# EAGLE design Rover_MDrv_V1_Sch (EAGLE 9.6.2)
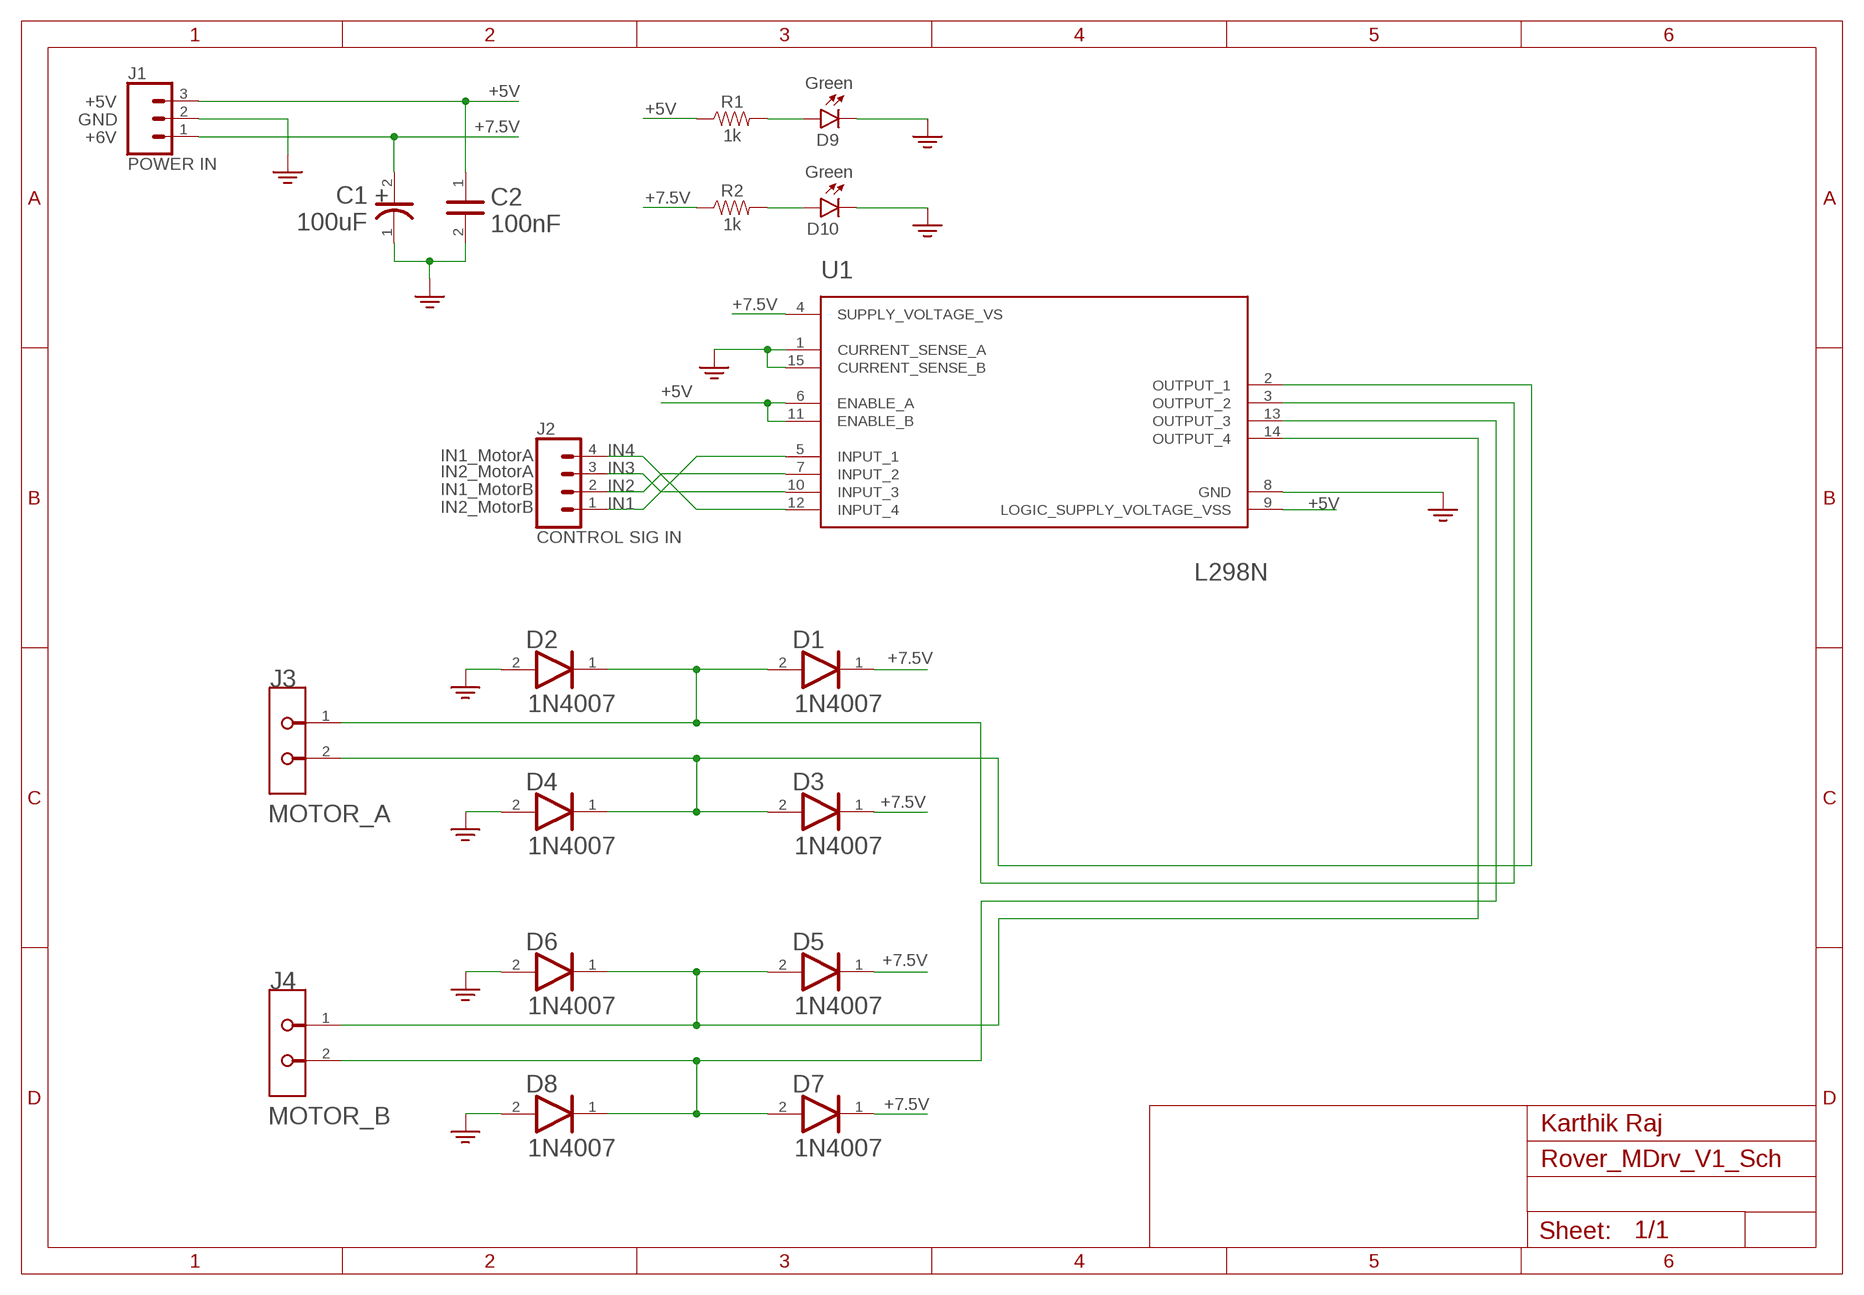
[diagram p0: schematic, sheet 1]

## Parts
C1  100uF  PANASONIC_EEU-FR1C101PANASONIC_EEU-FR1C101_0_0  [PANASONIC_EEU-FR1C101_0]
C2  100nF  AVX_CK05BX104KAVX_CK05BX104K_0_0  [AVX_CK05BX104K_0]
D1  DIOTEC_1N4007DIOTEC_1N4007_0_0  [DIOTEC_1N4007_0]
D2  DIOTEC_1N4007DIOTEC_1N4007_0_0  [DIOTEC_1N4007_0]
D3  DIOTEC_1N4007DIOTEC_1N4007_0_0  [DIOTEC_1N4007_0]
D4  DIOTEC_1N4007DIOTEC_1N4007_0_0  [DIOTEC_1N4007_0]
D5  DIOTEC_1N4007DIOTEC_1N4007_0_0  [DIOTEC_1N4007_0]
D6  DIOTEC_1N4007DIOTEC_1N4007_0_0  [DIOTEC_1N4007_0]
D7  DIOTEC_1N4007DIOTEC_1N4007_0_0  [DIOTEC_1N4007_0]
D8  DIOTEC_1N4007DIOTEC_1N4007_0_0  [DIOTEC_1N4007_0]
D9  Green  LED3MM  [LED_3MM]
D10  Green  LED3MM  [LED_3MM]
J1  POWER IN  CONN_03  [1X03]
J2  CONTROL SIG IN  CONN_04PTH  [1X04]
J3  MOTOR_A  TE_282837-2TE_282837-2_0_0  [TE_282837-2_0]
J4  MOTOR_B  TE_282837-2TE_282837-2_0_0  [TE_282837-2_0]
R1  1k  RESISTORAXIAL-0.3  [AXIAL-0.3]
R2  1k  RESISTORAXIAL-0.3  [AXIAL-0.3]
U1  STMICROELECTRONICS_L298NSTMICROELECTRONICS_L298N_0_0  [STMICROELECTRONICS_L298N_0]

## Nets
+5V: C2.1 J1.3 R1.P$1 U1.6(ENABLE_A) U1.9(LOGIC_SUPPLY_VOLTAGE_VSS) U1.11(ENABLE_B)
+7.5V: C1.2(ANODE) D1.1(CATHODE) D3.1(CATHODE) D5.1(CATHODE) D7.1(CATHODE) J1.1 R2.P$1 U1.4(SUPPLY_VOLTAGE_VS)
GND: C1.1(CATHODE) C2.2 D2.2(ANODE) D4.2(ANODE) D6.2(ANODE) D8.2(ANODE) D9.K(C) D10.K(C) J1.2 U1.1(CURRENT_SENSE_A) U1.8(GND) U1.15(CURRENT_SENSE_B) ; supply symbol labelled GND2
IN1: J2.1 U1.5(INPUT_1)
IN2: J2.2 U1.7(INPUT_2)
IN3: J2.3 U1.10(INPUT_3)
IN4: J2.4 U1.12(INPUT_4)
N$1: D9.A R1.P$2
N$2: D10.A R2.P$2
OUT1: D3.2(ANODE) D4.1(CATHODE) J3.2 U1.2(OUTPUT_1)
OUT2: D1.2(ANODE) D2.1(CATHODE) J3.1 U1.3(OUTPUT_2)
OUT3: D7.2(ANODE) D8.1(CATHODE) J4.2 U1.13(OUTPUT_3)
OUT4: D5.2(ANODE) D6.1(CATHODE) J4.1 U1.14(OUTPUT_4)

## Notes on the sheet
- +5V
- GND
- +6V
- IN1_MotorA
- IN2_MotorA
- IN1_MotorB
- IN2_MotorB
- Karthik Raj

## Library data of the parts
C1 = RMDrv_100uF_FilCap_16SEPC100M:PANASONIC_EEU-FR1C101: Aluminum Electrolytic Capacitors (Radial Lead Type); CAPACITANCE: 100.0µF; CENTROID_NOT_SPECIFIED: No; DATASHEET: https://industrial.panasonic.com/cdbs/www-data/pdf/RDF0000/ABA0000C1259.pdf; DIGIKEY_DESCRIPTION: CAP 100µF 16V Aluminum Electrolytic Capacitors Radial, Can 5000 Hrs @ 105°C; DIGIKEY_PART_NUMBER: P14391-ND; LEAD_FREE: yes; MF: Panasonic; MOUSER_PART_NUMBER: 667-EEU-FR1C101; MPN: EEU-FR1C101; PACKAGE: RADIAL; PREFIX: C; ROHS: yes; TEMPERATURE_RANGE_HIGH: +105°C; TEMPERATURE_RANGE_LOW: 40°C; VOLTAGE: 16V
C2 = RMDrv_0.1uF_FilCap_CK05BX104K:AVX_CK05BX104K: Multilayer Ceramic Capacitors; CAPACITANCE: 100.0nF; CENTROID_NOT_SPECIFIED: Yes; DATASHEET: http://datasheets.avx.com/CK05-06.pdf; DIGIKEY_DESCRIPTION: CAP 0.10µF ±10% 50V Ceramic Capacitor BX Radial; DIGIKEY_PART_NUMBER: 1010-1198-ND; IMPORTED_FROM: octopart; IPC_LAND_PATTERN_NAME: CAPRD508W85D483H483; LEAD_FREE: Unknown; MF: AVX; MOUNTING_TYPE: through hole; MOUSER_PART_NUMBER: 581-CK05BX104K; MPN: CK05BX104K; NUM_PINS: 2; PACKAGE: CAP_SMT_4MM83_2MM29; PREFIX: C; ROHS: Unknown; SYMBOL_0_0: Capacitor; TEMPERATURE_COEFFICIENT: BX; TEMPERATURE_RANGE_HIGH: +125°C; TEMPERATURE_RANGE_LOW: -55°C; TOLERANCE: ±10%; TYPE: capacitor; VOLTAGE: 50V
D1-D8 = 1N4007:DIOTEC_1N4007: Rectifier diode 1000 V 1 A DO-41, ,; AUTOMOTIVE: No; CAPACITANCE: 15pF; CENTROID_NOT_SPECIFIED: No; DATASHEET: https://datasheet.octopart.com/1N4007-Diotec-datasheet-62346875.pdf; DEVICE_CLASS_L1: Discrete Semiconductors; DEVICE_CLASS_L2: Diodes; DEVICE_CLASS_L3: Rectifier Diodes; FOOTPRINT_PARAMETERS_0: {"fp_type":"Axial","params":{"N":{"long name":"Number of leads","type":"fixed","short name":"N","value":2},"L":{"nom":false,"long name":"Package length","min":false,"max":5200000,"short name":"L","type":"measurement"},"D":{"nom":false,"long name":"Package diameter","min":false,"max":2800000,"short name":"D","type":"measurement"},"d":{"nom":770000,"long name":"Lead diameter","min":700000,"max":840000,"short name":"d","type":"measurement"},"e":{"nom":8880000,"long name":"Lead spacing","min":null,"max":null,"short name":"e","type":"measurement"},"P":{"default":"false","long name":"Polarized","type":"multichoice","short name":"P"},"offset x":{"nom":0,"long name":"X Center offset","min":null,"max":null,"short name":"offset x","type":"measurement"},"offset y":{"nom":0,"long name":"Y Center offset","min":null,"max":null,"short name":"offset y","type":"measurement"},"LS":{"default":"Circle","long name":"Land shape","type":"multichoice","short name":"LS"},"LS1":{"default":"Square","long name":"Land shape (Pin 1)","type":"multichoice","short name":"LS1"}}}; FOOTPRINT_VARIANT_NAME_0: Recommended_Land_Pattern; FORWARD_CURRENT: 1A; HEIGHT: 2.8mm; IPC_LAND_PATTERN_NAME: DIOAD888W100L520D280; LEAD_FREE: Yes; MAX_JUNCTION_TEMP: +175°C; MAX_REPETITIVE_REVERSE_VOLTAGE: 1000V; MAX_SURGE_FORWARD_CURRENT: 27A; MF: Diotec; MFG_PACKAGE_IDENT: 1N4007; MFG_PACKAGE_IDENT_DATE: 0; MFG_PACKAGE_IDENT_REV: 0; MPN: 1N4007; PACKAGE: AXIAL; PEAK_REVERSE_CURRENT: 5uA; PREFIX: D; REVERSE_VOLTAGE: 1000V; ROHS: Yes; TEMPERATURE_RANGE_HIGH: +175°C; TEMPERATURE_RANGE_LOW: -50°C; VERIFICATION_VERSION: 0.0.0.3
D9 D10 = SparkFun-LED:LED: LED (Generic) Standard schematic elements and footprints for 5mm, 3mm, 1206, and 0603 sized LEDs. Generic LEDs with no color specified.; PROD_ID: DIO-08794
J1 = SparkFun-Connectors:CONN_03: Multi connection point. Often used as Generic Header-pin footprint for 0.1 inch spaced/style header connections On any of the 0.1 inch spaced packages, you can populate with these: Break Away Headers - Straight <https://www.sparkfun.com/products/116> (PRT-00116) Break Away Male Headers - Right Angle <https://www.sparkfun.com/products/553> (PRT-00553) Female Headers <https://www.sparkfun.com/products/115> (PRT-00115) Break Away Headers - Machine Pin <https://www.sparkfun.com/products/117> (PRT-00117) Break Away Female Headers - Swiss Machine Pin <https://www.sparkfun.com/products/743> (PRT-00743) Stackable Header - 3 Pin (Female, 0.1") <https://www.sparkfun.com/products/13875> (PRT-13875) For SCREWTERMINALS and SPRING TERMINALS visit here: Screw Terimnals on SparkFun.com <https://www.sparkfun.com/search/results?term=Screw+Terminals> (5mm/3.5mm/2.54mm spacing) This device is also useful as a general connection point to wire up your design to another part of your project. Our various solder wires solder well into these plated through hole pads. Hook-Up Wire - Assortment (Stranded, 22 AWG) <https://www.sparkfun.com/products/11375> (PRT-11375) Hook-Up Wire - Assortment (Solid Core, 22 AWG) <https://www.sparkfun.com/products/11367> (PRT-11367) View the entire wire category on our website here <https://www.sparkfun.com/categories/141> Special notes: Molex polarized connector foot print use with SKU : PRT-08232 with associated crimp pins and housings.; PROD_ID: XXX-00000; VALUE: 455-1750-1-ND
J2 = SparkFun-Connectors:CONN_04: Multi connection point. Often used as Generic Header-pin footprint for 0.1 inch spaced/style header connections On any of the 0.1 inch spaced packages, you can populate with these: Break Away Headers - Straight <https://www.sparkfun.com/products/116> (PRT-00116) Break Away Male Headers - Right Angle <https://www.sparkfun.com/products/553> (PRT-00553) Female Headers <https://www.sparkfun.com/products/115> (PRT-00115) Break Away Headers - Machine Pin <https://www.sparkfun.com/products/117> (PRT-00117) Break Away Female Headers - Swiss Machine Pin <https://www.sparkfun.com/products/743> (PRT-00743) For SCREWTERMINALS and SPRING TERMINALS visit here: Screw Terimnals on SparkFun.com <https://www.sparkfun.com/search/results?term=Screw+Terminals> (5mm/3.5mm/2.54mm spacing) This device is also useful as a general connection point to wire up your design to another part of your project. Our various solder wires solder well into these plated through hole pads. Hook-Up Wire - Assortment (Stranded, 22 AWG) <https://www.sparkfun.com/products/11375> (PRT-11375) Hook-Up Wire - Assortment (Solid Core, 22 AWG) <https://www.sparkfun.com/products/11367> (PRT-11367) View the entire wire category on our website here <https://www.sparkfun.com/categories/141> Special notes: Molex polarized connector foot print use with SKU : PRT-08231 with associated crimp pins and housings. 1MM SMD Version SKU: PRT-10208; PROD_ID: CONN-09696
J3 J4 = RMDrv_FinalNew_Conn_Terminal:TE_282837-2: Conn Terminal Blocks F 2 POS 5.08mm Solder ST Thru-Hole 13.5A/Contact; CENTROID_NOT_SPECIFIED: No; CONN_GENDER: Female; CONN_ORIENTATION: Horizontal; CONTACT_MATERIAL: Tin; CURRENT_RATING: 13.5A; DATASHEET: https://www.te.com/commerce/DocumentDelivery/DDEController?Action=showdoc&DocId=Catalog+Section%7F1308389_EUROSTYLE_TERMINAL_BLOCKS%7F0607%7Fpdf%7FEnglish%7FENG_CS_1308389_EUROSTYLE_TERMINAL_BLOCKS_0607.pdf%7F282837-2; DEVICE_CLASS_L1: Connectors; DEVICE_CLASS_L2: Terminal Blocks | Terminals; DEVICE_CLASS_L3: unset; DIGIKEY_DESCRIPTION: CONN TERM BLOCK 5.08MM 2POS SIDE ENTY; DIGIKEY_PART_NUMBER: A113320-ND; FOOTPRINT_URL: https://www.te.com/commerce/DocumentDelivery/DDEController?Action=showdoc&DocId=Customer+Drawing%7F282837%7FH%7Fpdf%7FEnglish%7FENG_CD_282837_H.pdf%7F282837-2; HEIGHT: 10.3mm; IS_FEMALE: yes; LEAD_FREE: yes; MAX_WIRE_GAUGE: 16; MF: TE; MFG_PACKAGE_IDENT: 282837-2; MFG_PACKAGE_IDENT_DATE: 0; MFG_PACKAGE_IDENT_REV: 0; MIN_WIRE_GAUGE: 30; MOUSER_DESCRIPTION: Fixed Terminal Blocks 5.08MM PCB MOUNT 2P; MOUSER_PART_NUMBER: 571-2828372; MPN: 282837-2; NUMBER_OF_CONTACTS: 2; NUMBER_OF_ROWS: 1; PACKAGE: HDR2; PREFIX: J; ROHS: yes; TEMPERATURE_RANGE_HIGH: +110°C; TEMPERATURE_RANGE_LOW: -40°C; VERIFICATION_VERSION: 0.0.0.1; VOLTAGE_RATING: 300V
R1 R2 = SparkFun-Resistors:RESISTOR: Generic Resistor Package
U1 = RMDrv_L298N:STMICROELECTRONICS_L298N: L298N DUAL FULL-BRIDGE DRIVER; CENTROID_NOT_SPECIFIED: No; DATASHEET: https://upverter.com/datasheet/4e6acc8e34692b9176918ad45905b166727b88f4.pdf; DIGIKEY_DESCRIPTION: IC BRIDGE DRIVER PAR 15MULTIWATT; DIGIKEY_PART_NUMBER: 497-1395-5-ND; IMPORTED_FROM: octopart; LEAD_FREE: yes; MAX_SUPPLY_VOLTAGE_DC: 46V; MF: STMicroelectronics; MOUNTING_TYPE: Through Hole; MOUSER_PART_NUMBER: 511-L298; MPN: L298N; NUM_PINS: 13; OCTOPART_PART_NUMBER: 8e8a47878f08514d; OUTPUT_CURRENT: 2A; OUTPUT_VOLTAGE: 46V; PACKAGE: Multiwatt15 Vertical; PREFIX: U; ROHS: yes; SYMBOL_0_0: Standard; TEMPERATURE_RANGE_HIGH: +150°C; TEMPERATURE_RANGE_LOW: -40°C; TYPE: integrated circuit

## Board
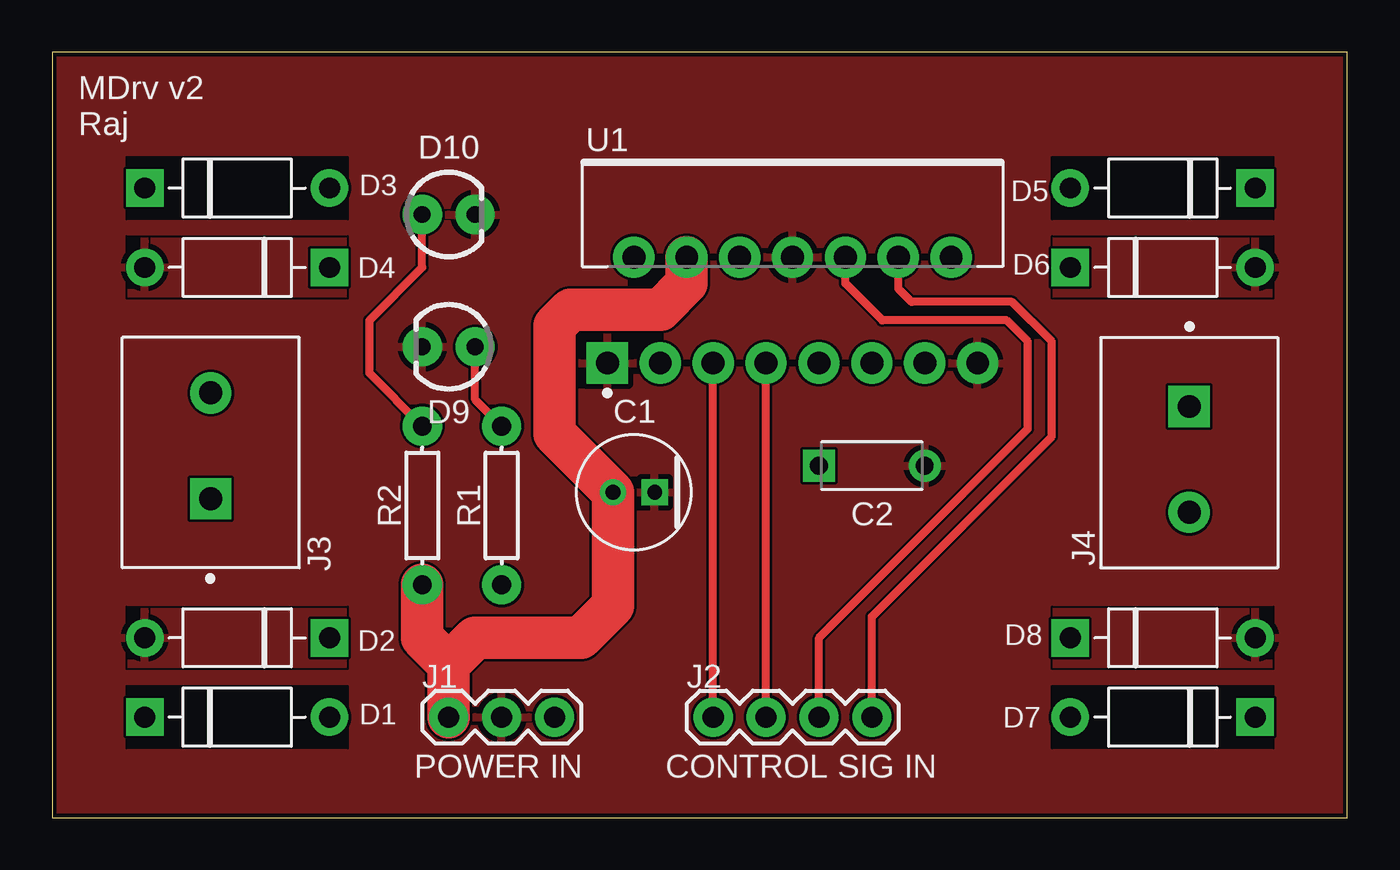
[diagram p1: board, top side]
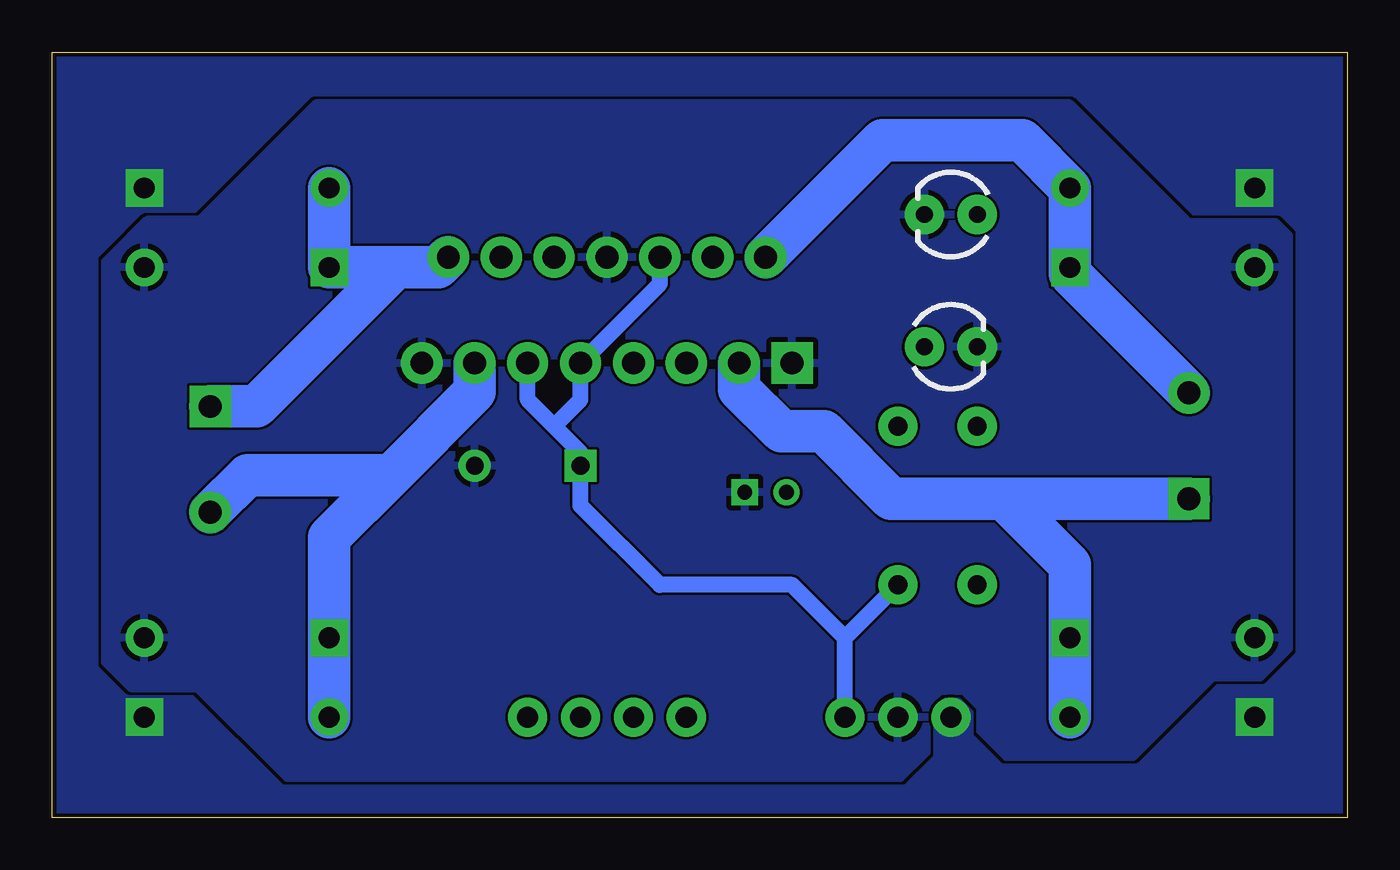
[diagram p2: board, bottom side, seen from below]

Size 62.21 x 36.75 mm. Coordinates in mm from the lower left corner, seen from the top.
Outline: 0,0 62.21,0 62.21,36.75 0,36.75 0,0
Copper layers (1*16): Top 0.035mm / dielectric 1.6mm / Bottom 0.035mm
Design rules "jlcpcb-2layers": minimum track width 5mil, minimum drill 0.3mm, track to track 5mil, track to pad 5mil, pad to pad 5mil, via to via 5mil, smd to smd 5mil, copper to edge 0.2mm, drill to drill 6mil, minimum pad ring 10mil, minimum via ring 3mil, stop-mask expansion 4mil, vias tented up to drill 0mil, thermal gap 10mil

### Footprints (pad centres in the part's own frame; a part is rotated, then mirrored left to right if it is on the bottom)
PANASONIC_EEU-FR1C101_0 = drill 0.7 pad 1.2 square: 1 -1,0 | drill 0.7 pad 1.2: 2 1,0
AVX_CK05BX104K_0 = drill 0.85 pad 1.35 square: 1 -2.54,0 | drill 0.85 pad 1.35: 2 2.54,0
DIOTEC_1N4007_0 = drill 1 pad 1.55 square: 1 -4.44,0 | drill 1 pad 1.55: 2 4.44,0
LED_3MM = drill 0.813 pad 1.88: A -1.27,0; K 1.27,0
1X03 = drill 1.016 pad 1.88: 1 0,0; 2 2.54,0; 3 5.08,0
1X04 = drill 1.016 pad 1.88: 1 0,0; 2 2.54,0; 3 5.08,0; 4 7.62,0
TE_282837-2_0 = drill 1.1 pad 1.7 square: 1 -2.215,0 | drill 1.1 pad 1.7: 2 2.865,0
AXIAL-0.3 = drill 0.9 pad 1.88: P$1 -3.81,0; P$2 3.81,0
STMICROELECTRONICS_L298N_0 = drill 1.1 pad 1.7 square: 1 -8.89,-7.13 | drill 1.1 pad 1.7: 2 -7.62,-2.05; 3 -6.35,-7.13; 4 -5.08,-2.05; 5 -3.81,-7.13; 6 -2.54,-2.05; 7 -1.27,-7.13; 8 0,-2.05; 9 1.27,-7.13; 10 2.54,-2.05; 11 3.81,-7.13; 12 5.08,-2.05; 13 6.35,-7.13; 14 7.62,-2.05; 15 8.89,-7.13

### Placement (x,y rotation side)
C1  27.94,15.62 180 top
C2  39.37,16.89 0 top
D1  8.89,4.83 0 top
D2  8.89,8.64 180 top
D3  8.89,30.23 0 top
D4  8.89,26.42 180 top
D5  53.34,30.23 180 top
D6  53.34,26.42 0 top
D7  53.34,4.83 180 top
D8  53.34,8.64 0 top
D9  19.05,22.61 180 top
D10  19.05,28.96 0 top
J1  19.05,4.83 0 top
J2  31.75,4.83 0 top
J3  7.62,17.53 90 top
J4  54.61,17.53 270 top
R1  21.59,14.99 90 top
R2  17.78,14.99 90 top
U1  35.56,28.96 0 top

### Tracks (layer width: path | path; a pad name or v marks a point on that pad's centre or on a via)
+5V
  Bottom 0.762: J1.3 24.13,8.64 | 24.13,8.64 R1.P$1 | 24.13,8.64 26.67,11.18 33.02,11.18 36.83,14.99 C2.1 36.83,17.53 38.1,18.8 | U1.11 39.37,20.07 38.1,18.8 | 38.1,18.8 36.83,20.07 U1.9 33.02,25.64 U1.6
+7.5V
  Top 2.032: J1.1 19.05,7.37 | 19.05,7.37 17.78,8.64 R2.P$1 | 19.05,7.37 20.32,8.64 25.4,8.64 26.94,10.18 C1.2 24.13,18.43 24.13,23.62 24.89,24.38 29.21,24.38 30.48,25.65 U1.4
  pour Bottom (rank 2, no thermals): 0,-0.25 62.23,-0.25 62.23,36.58 0,36.58
GND
  pour Bottom: 19.05,6.1 18.41,6.1 18.29,5.97 17.65,5.33 17.65,4.19 16.38,2.92 10.29,2.92 6.73,6.48 6.48,6.73 4.19,6.73 3.3,7.62 2.79,8.13 2.79,27.94 3.43,28.58 7.62,28.58 13.33,34.29 46.48,34.29 49.53,34.29 55.12,28.7 57.66,28.7 59.31,27.05 59.69,26.67 59.69,7.49 58.42,6.22 56.01,6.22 55.25,6.22 50.93,1.91 21.46,1.91 20.32,3.05 20.19,3.17 20.19,5.46 19.56,6.1
  pour Top: 0,36.58 0,-0.25 62.23,-0.25 62.23,36.58
IN1
  Top 0.381: J2.1 U1.5
IN2
  Top 0.381: J2.2 U1.7
IN3
  Top 0.381: J2.3 36.83,8.64 46.86,18.67 46.86,22.86 45.85,23.88 39.88,23.88 38.1,25.65 U1.10
IN4
  Top 0.381: J2.4 39.37,9.65 48.01,18.29 48.01,22.86 46.1,24.77 41.28,24.77 40.64,25.4 U1.12
N$1
  Top 0.381: R1.P$2 20.32,20.07 D9.A
N$2
  Top 0.381: R2.P$2 15.24,21.34 15.24,23.88 17.78,26.42 D10.A
OUT1
  Bottom 2.032: U1.2 22.33,32.51 15.62,32.51 D3.2 D4.1 13.33,26.1 J3.2
OUT2
  Bottom 2.032: U1.3 29.21,20.57 27.18,18.54 25.15,18.54 21.91,15.31 16.51,15.31 | 16.51,15.31 J3.1 | 16.51,15.31 13.33,12.13 D2.1 D1.2
OUT3
  Bottom 2.032: U1.13 41.91,20.45 45.91,16.45 | 45.91,16.45 48.9,13.46 D8.1 D7.2 | 45.91,16.45 52.82,16.45 J4.2
OUT4
  Bottom 2.032: U1.14 43.67,26.42 45.72,26.42 | 45.72,26.42 D6.1 D5.2 | 45.72,26.42 52.4,19.74 J4.1

### Text on the board
tPlace: MDrv v2 / Raj